# Altium project Module_Ethernet_W5500_V1.0.PrjPcb
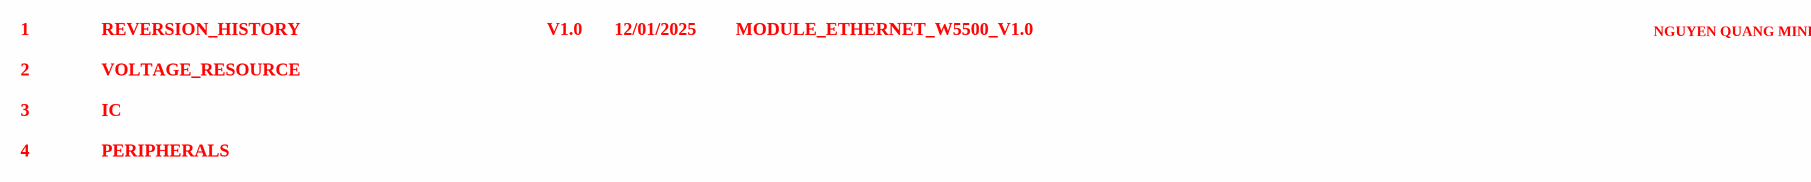
[diagram p0: REVERSION_HISTORY.SchDoc]
4 sheets, 48 parts. Net scope: global (net labels, ports and power ports of the same name join across sheets).
Board files: PCB_V1.0.PcbDoc, Draft_PCB.PcbDoc
Sheets:
  REVERSION_HISTORY.SchDoc
  VOLTAGE_RESOURCE.SchDoc
  IC.SchDoc
  PERIPHERALS.SchDoc

## Sheet REVERSION_HISTORY.SchDoc: REVERSION_HISTORY
size A3; SheetNumber: 1; SheetTotal: 4; ProjectTitle: Module_Ethernet_W5500

### Notes on the sheet
- 1
- REVERSION_HISTORY
- V1.0
- 12/01/2025
- MODULE_ETHERNET_W5500_V1.0
- NGUYEN QUANG MINH
- 2
- 3
- VOLTAGE_RESOURCE
- IC
- 4
- PERIPHERALS
- TABLES OF CONTENTS
- REVISION HISTORY
- PAGE
- CONTENTS
- VER#
- DATE
- REVISIONS
- DESCRIPTION OF CHANGES
- AUTHOR
- Author:
- Title:
- Size:
- A3
- Project:
- Revision:
- Modified Date:
- CheckedBy:
- Date:
- SW Version:

## Sheet VOLTAGE_RESOURCE.SchDoc: VOLTAGE_RESOURCE
size A4; Organization: My Company; Address1: Address Line 1; Address2: Address Line 2; Address3: Address Line 3; Address4: Address Line 4; SheetNumber: 2; SheetTotal: 4; ProjectTitle: Module_Ethernet_W5500
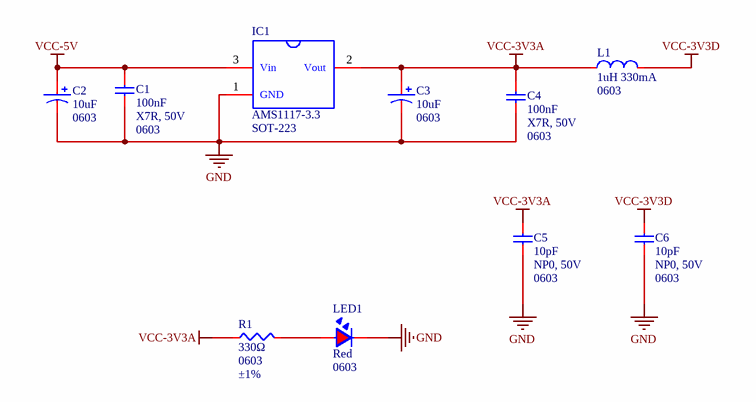
[diagram p1: VOLTAGE_RESOURCE.SchDoc]

### Parts
C1  100nF  Temperature Coefficient: X7R, 50V  Package: 0603  [C0603]
C2  10uF  Package: 0603  [C0603 - TANTA]
C3  10uF  Package: 0603  [C0603 - TANTA]
C4  100nF  Temperature Coefficient: X7R, 50V  Package: 0603  [C0603]
C5  10pF  Temperature Coefficient: NP0, 50V  Package: 0603  [C0603]
C6  10pF  Temperature Coefficient: NP0, 50V  Package: 0603  [C0603]
IC1  AMS1117-3.3  [SOT-223]
L1  1uH 330mA  Package: 0603  [L_0603]
LED1  Red  Package: 0603  [LED0603_RED]
R1  330Ω  Package: 0603  Tolerance: ±1%  [R0603]

### Nets
GND: C1.1 C2.2 C3.2 C4.1 C5.1 C6.1 IC1.1(GND) LED1.2
VCC-3V3A: C3.1 C4.2 C5.2 IC1.2(Vout) L1.1 R1.1
VCC-3V3D: C6.2 L1.2
VCC-5V: C1.2 C2.1 IC1.3(Vin)
NetLED1_1: LED1.1 R1.2

### Notes on the sheet
- Author:
- Title:
- Size:
- A4
- Project:
- Approved:
- Revision:
- Modified Date:
- CONFIDENTIAL
- Date:
- SW Version:

### Library data of the parts
C1 C4 = C0603_MLCC_100nF_X7R_50V: 50V 100nF X7R ±10% 0603 Multilayer Ceramic Capacitors MLCC - SMD/SMT ROHS; Manufacturer: YAGEO; Mfr. Part: CC0603KRX7R9BB104; LCSC Part: C14663; Capacitance: 100nF; Link: https://www.lcsc.com/product-detail/C14663.html; Tolerance: ±10%; Voltage Rating: 50V
C2 C3 = C0603_TANTA_10uF_6.3V: 10uF ±20% 6.3V Tantalum Capacitors 10Ω@100kHz 0603; Manufacturer: VISHAY; Mfr. Part: TMCJ0J106MTRF; Equivalent Series Resistance(ESR): 10H@100kHz; LCSC Part: C1953982; Capacitance: 10uF; Link: https://www.lcsc.com/product-detail/C1953982.html; Tolerance: ±20%; Voltage Rating: 6.3V; Operating Temperature: -55℃~+125℃
C5 C6 = C0603_MLCC_10pF_NP0_50V: 50V 10pF NP0 ±5% 0603 Multilayer Ceramic Capacitors MLCC - SMD/SMT ROHS; Manufacturer: YAGEO; Mfr. Part: CC0603JRNPO9BN100; LCSC Part: C106245; Capacitance: 10pF; Link: https://www.lcsc.com/product-detail/C106245.html; Tolerance: ±5%; Voltage Rating: 50V
IC1 = AMS1117-3.3_SOT-223: 72dB@(120Hz) 1A Fixed 3.3V Positive 16V SOT-223 Voltage Regulators - Linear, Low Drop Out (LDO) Regulators ROHS; Manufacturer: Advanced Monolithic Systems; Voltage Dropout: 1.1V@(800mA); Number of Outputs: 1; Mfr. Part: AMS1117-3.3; LCSC Part: C6186; Link: https://www.lcsc.com/product-detail/C6186.html?s_z=n_AMS1117-3.3; Category: Power Management (PMIC)/Voltage Regulators - Linear, Low Drop Out (LDO) Regulators; Output Current: 1A; Output Voltage: 3.3V; Output Configuration: Positive; Operating Temperature: -40℃~+125℃; Voltage - Supply: 16V; Package: SOT-223
L1 = L_1uH_0603_330mA: 330mA 1uH ±10% 810mΩ Wire-wound chip inductor 0603 Fixed Inductors RoHS; Manufacturer: APV; Manufacture Part Number: AHW1608F-1R0KTF; Link: https://www.lcsc.com/product-detail/C6364703.html; Inductor: 1uH; Current: 330mA; LCSC Part: C6364703
LED1 = LED0603_Red: 20mA 230mcd Water Clear -40℃~+85℃ 630nm Red 120° 75mW 1.95V 0603 LED Indication - Discrete ROHS; Manufacturer: Kingbright; Mfr. Part: APT1608SURCK; Key Attributes: 1.6 x 0.8 mm SMD Chip LED Lamp; LCSC Part: C5875723; Illumination Color: Red; Power(Watts): 75mW; Voltage - Forward(Vf): 1.95V; Forward Current: 20mA; Operating Temperature: -40℃~+85℃; Link: https://www.lcsc.com/product-detail/C5875723.html
R1 = R0603_330Ω_±1%: 100mW Thick Film Resistor 75V ±100ppm/℃ ±1% 330Ω 0603 Chip Resistor - Surface Mount ROHS; Manufacturer: YAGEO; Mfr. Part: RC0603FR-07330RL; LCSC Part: C105881; Resistance: 330Ω; Operating Temperature: -55℃~+155℃; Link: https://www.lcsc.com/product-detail/C105881.html

## Sheet IC.SchDoc: IC
size A4; Organization: My Company; Address1: Address Line 1; Address2: Address Line 2; Address3: Address Line 3; Address4: Address Line 4; SheetNumber: 3; SheetTotal: 4; ProjectTitle: Module_Ethernet_W5500
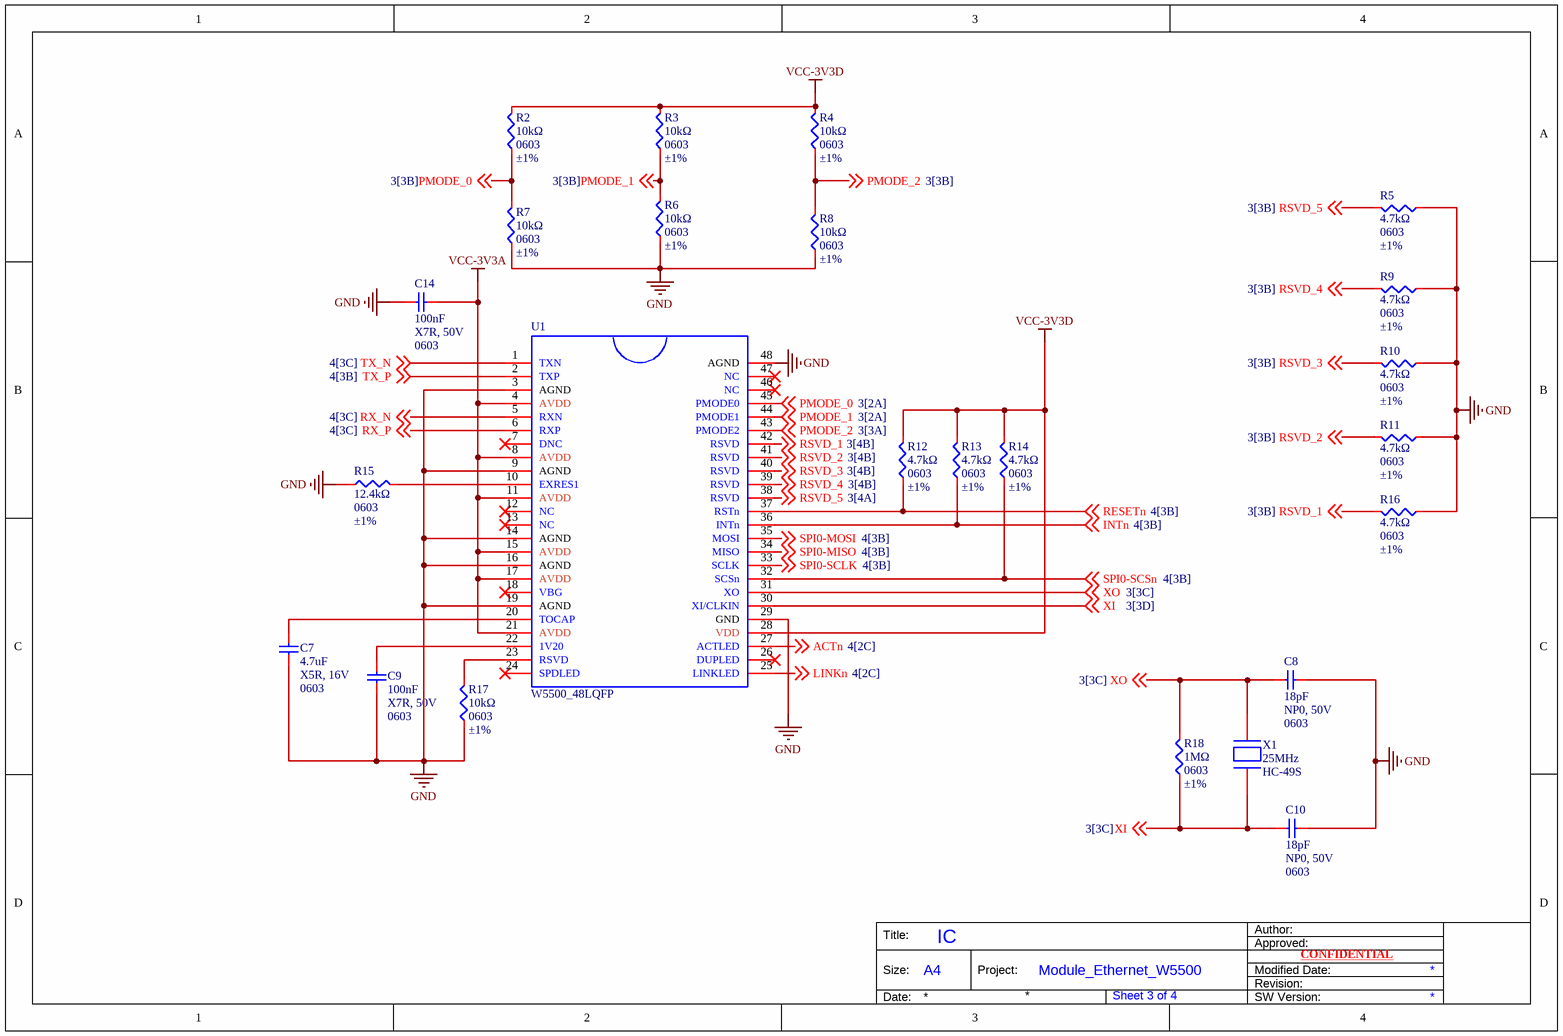
[diagram p2: IC.SchDoc]

### Parts
C7  4.7uF  Temperature Coefficient: X5R, 16V  Package: 0603  [C0603]
C8  18pF  Temperature Coefficient: NP0, 50V  Package: 0603  [C0603]
C9  100nF  Temperature Coefficient: X7R, 50V  Package: 0603  [C0603]
C10  18pF  Temperature Coefficient: NP0, 50V  Package: 0603  [C0603]
C14  100nF  Temperature Coefficient: X7R, 50V  Package: 0603  [C0603]
R2  10kΩ  Package: 0603  Tolerance: ±1%  [R0603]
R3  10kΩ  Package: 0603  Tolerance: ±1%  [R0603]
R4  10kΩ  Package: 0603  Tolerance: ±1%  [R0603]
R5  4.7kΩ  Package: 0603  Tolerance: ±1%  [R0603]
R6  10kΩ  Package: 0603  Tolerance: ±1%  [R0603]
R7  10kΩ  Package: 0603  Tolerance: ±1%  [R0603]
R8  10kΩ  Package: 0603  Tolerance: ±1%  [R0603]
R9  4.7kΩ  Package: 0603  Tolerance: ±1%  [R0603]
R10  4.7kΩ  Package: 0603  Tolerance: ±1%  [R0603]
R11  4.7kΩ  Package: 0603  Tolerance: ±1%  [R0603]
R12  4.7kΩ  Package: 0603  Tolerance: ±1%  [R0603]
R13  4.7kΩ  Package: 0603  Tolerance: ±1%  [R0603]
R14  4.7kΩ  Package: 0603  Tolerance: ±1%  [R0603]
R15  12.4kΩ  Package: 0603  Tolerance: ±1%  [R0603]
R16  4.7kΩ  Package: 0603  Tolerance: ±1%  [R0603]
R17  10kΩ  Package: 0603  Tolerance: ±1%  [R0603]
R18  1MΩ  Package: 0603  Tolerance: ±1%  [R0603]
U1  W5500_48LQFP  [48LQFP (7*7)]
X1  25MHz  [HC-49S]

### Nets
GND: C7.1 C8.2 C9.1 C10.2 C14.2 R5.1 R6.1 R7.1 R8.1 R9.1 R10.1 R11.1 R15.1 R16.1 R17.1 U1.3(AGND) U1.9(AGND) U1.14(AGND) U1.16(AGND) U1.19(AGND) U1.29(GND) U1.48(AGND)
VCC-3V3A: C14.1 U1.4(AVDD) U1.8(AVDD) U1.11(AVDD) U1.15(AVDD) U1.17(AVDD) U1.21(AVDD)
VCC-3V3D: R2.2 R3.2 R4.2 R12.2 R13.2 R14.2 U1.28(VDD)
ACTn: U1.27(ACTLED) ; off-sheet ACTn
INTn: R13.1 U1.36(INTn) ; off-sheet INTn
LINKn: U1.25(LINKLED) ; off-sheet LINKn
PMODE_0: R2.1 R7.2 U1.45(PMODE0) ; off-sheet PMODE_0
PMODE_1: R3.1 R6.2 U1.44(PMODE1) ; off-sheet PMODE_1
PMODE_2: R4.1 R8.2 U1.43(PMODE2) ; off-sheet PMODE_2
RESETn: R12.1 U1.37(RSTn) ; off-sheet RESETn
RSVD_1: R16.2 U1.42(RSVD) ; off-sheet RSVD_1
RSVD_2: R11.2 U1.41(RSVD) ; off-sheet RSVD_2
RSVD_3: R10.2 U1.40(RSVD) ; off-sheet RSVD_3
RSVD_4: R9.2 U1.39(RSVD) ; off-sheet RSVD_4
RSVD_5: R5.2 U1.38(RSVD) ; off-sheet RSVD_5
RX_N: U1.5(RXN) ; off-sheet RX_N
RX_P: U1.6(RXP) ; off-sheet RX_P
SPI0-MISO: U1.34(MISO) ; off-sheet SPI0-MISO
SPI0-MOSI: U1.35(MOSI) ; off-sheet SPI0-MOSI
SPI0-SCLK: U1.33(SCLK) ; off-sheet SPI0-SCLK
SPI0-SCSn: R14.1 U1.32(SCSn) ; off-sheet SPI0-SCSn
TX_N: U1.1(TXN) ; off-sheet TX_N
TX_P: U1.2(TXP) ; off-sheet TX_P
XI: C10.1 R18.1 U1.30(XI/CLKIN) X1.1 ; off-sheet XI
XO: C8.1 R18.2 U1.31(XO) X1.2 ; off-sheet XO
NetC7_2: C7.2 U1.20(TOCAP)
NetC9_2: C9.2 U1.22(1V20)
NetR15_2: R15.2 U1.10(EXRES1)
NetR17_2: R17.2 U1.23(RSVD)

Not connected (* = marked no-connect by the designer): U1 7(DNC)* 12(NC)* 13(NC)* 18(VBG)* 24(SPDLED)* 26(DUPLED)* 46(NC)* 47(NC)*

### Notes on the sheet
- Author:
- Title:
- Size:
- A4
- Project:
- Approved:
- Revision:
- Modified Date:
- CONFIDENTIAL
- Date:
- SW Version:

### Library data of the parts
C7 = C0603_MLCC_4.7uF_X5R_16V: 4.7uF ±10% 16V Ceramic Capacitor X5R 0603; Manufacturer: Samsung Electro-Mechanics; Mfr. Part: CL10A475KO8NNNC; LCSC Part: C19666; Capacitance: 4.7uF; Link: https://www.lcsc.com/product-detail/C19666.html; Voltage Rating: 16V; Tolerance: ±10%
C8 C10 = C0603_MLCC_18pF_NP0_50V: 18pF ±5% 50V Ceramic Capacitor NP0 0603; Manufacturer: YAGEO; Mfr. Part: CC0603JRNPO9BN180; LCSC Part: C107040; Capacitance: 18pF; Link: https://www.lcsc.com/product-detail/C107040.html; Tolerance: ±5%; Voltage Rating: 50V
C9 C14 = C0603_MLCC_100nF_X7R_50V: as C1 on sheet VOLTAGE_RESOURCE; LCSC Part: C14663; Capacitance: 100nF; Link: https://www.lcsc.com/product-detail/C14663.html; Tolerance: ±10%; Voltage Rating: 50V
R2-R4 R6-R8 R17 = R0603_10kΩ_±1%: 100mW Thick Film Resistor 75V ±100ppm/℃ ±1% 10kΩ 0603 Chip Resistor - Surface Mount ROHS; Manufacturer: YAGEO; Mfr. Part: RC0603FR-0710KL; LCSC Part: C98220; Resistance: 10kΩ; Operating Temperature: -55℃~+155℃; Link: https://www.lcsc.com/product-detail/C98220.html
R5 R9-R14 R16 = R0603_4.7kΩ_±1%: 100mW Thick Film Resistor 75V ±100ppm/℃ ±1% 4.7kΩ 0603 Chip Resistor - Surface Mount ROHS; Manufacturer: YAGEO; Mfr. Part: RC0603FR-074K7L; LCSC Part: C99782; Resistance: 4.7kΩ; Operating Temperature: -55℃~+155℃; Link: https://www.lcsc.com/product-detail/C99782.html
R15 = R0603_12.4kΩ_±1%: 100mW 12.4kΩ 75V Thick Film Resistor ±100ppm/℃ ±1% 0603 Chip Resistor - Surface Mount RoHS; Manufacturer: YAGEO; Mfr. Part: RC0603FR-0712K4L; LCSC Part: C137798; Resistance: 12.4kΩ; Operating Temperature: -55℃~+155℃; Link: https://www.lcsc.com/product-detail/C137798.html
R18 = R0603_1MΩ_±1%: 100mW Thick Film Resistor 75V ±100ppm/℃ ±1% 1MΩ 0603 Chip Resistor - Surface Mount ROHS; Manufacturer: YAGEO; Mfr. Part: RC0603FR-071ML; LCSC Part: C105578; Resistance: 1MΩ; Operating Temperature: -55℃~+155℃; Link: https://www.lcsc.com/product-detail/C105578.html
U1 = W5500_48LQFP: LQFP-48(7x7) Interface Controllers RoHS; Manufacturer: WIZNETTHE TICKET; Mfr. Part: TPS61175PWPR; Voltage - Supply: 3.3V; Ethernet Speed Standards: 10BASE-T; 100BASE-TX; Protocol: SPI; Memory Space: 32KB; Number of Channels: 8; Package: LQFP-48(7x7); LCSC Part: C32843; Link: https://www.lcsc.com/product-detail/C32843.html?s_z=n_w5500%252048lqfp; MAC Interface: SPI; Operating Temperature: -40℃~+85℃
X1 = Crystal_25Mhz_HC49S: Crystal 25MHz ±20ppm 20pF HC-49S; Manufacturer: YXC Crystal Oscillators; Mfr. Part: X49SD25MSD2SC; Frequency Stability: ±30ppm; LCSC Part: C14730; Frequency: 25MHz; Type: Through Hole Crystal Oscillator; Load Capacitance: 20pF; Operating Temperature: -20℃~+70℃; Link: https://www.lcsc.com/product-detail/C14730.html; Package: HC-49S

## Sheet PERIPHERALS.SchDoc: PERIPHERALS
size A4; Organization: My Company; Address1: Address Line 1; Address2: Address Line 2; Address3: Address Line 3; Address4: Address Line 4; SheetNumber: 4; SheetTotal: 4; ProjectTitle: Module_Ethernet_W5500
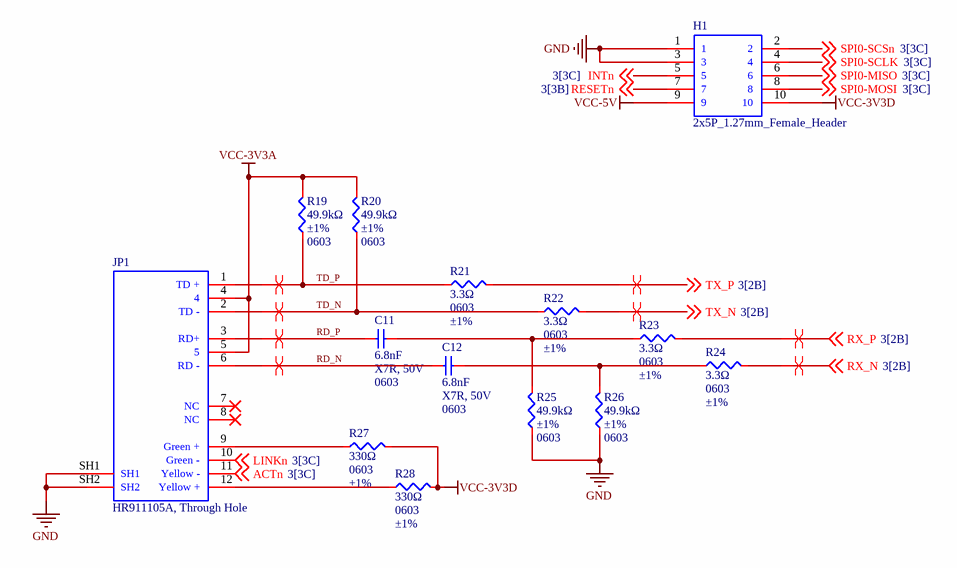
[diagram p3: PERIPHERALS.SchDoc]

### Parts
C11  6.8nF  Temperature Coefficient: X7R, 50V  Package: 0603  [C0603]
C12  6.8nF  Temperature Coefficient: X7R, 50V  Package: 0603  [C0603]
H1  2x5P_1.27mm_Female_Header  [2x5P, 1.27mm, Female Header]
JP1  HR911105A, Through Hole  [HR911105A]
R19  49.9kΩ  Tolerance: ±1%  Package: 0603  [R0603]
R20  49.9kΩ  Tolerance: ±1%  Package: 0603  [R0603]
R21  3.3Ω  Package: 0603  Tolerance: ±1%  [R0603]
R22  3.3Ω  Package: 0603  Tolerance: ±1%  [R0603]
R23  3.3Ω  Package: 0603  Tolerance: ±1%  [R0603]
R24  3.3Ω  Package: 0603  Tolerance: ±1%  [R0603]
R25  49.9kΩ  Tolerance: ±1%  Package: 0603  [R0603]
R26  49.9kΩ  Tolerance: ±1%  Package: 0603  [R0603]
R27  330Ω  Package: 0603  Tolerance: ±1%  [R0603]
R28  330Ω  Package: 0603  Tolerance: ±1%  [R0603]

### Nets
GND: H1.1 H1.3 JP1.SH1 JP1.SH2 R25.1 R26.1
VCC-3V3A: JP1.4 JP1.5 R19.2 R20.2
VCC-3V3D: H1.10 R27.2 R28.2
VCC-5V: H1.9
ACTn: JP1.11(Yellow_-) ; off-sheet ACTn
INTn: H1.5 ; off-sheet INTn
LINKn: JP1.10(Green_-) ; off-sheet LINKn
RD_N: C12.1 JP1.6(RD_-)
RD_P: C11.1 JP1.3(RD+)
RESETn: H1.7 ; off-sheet RESETn
RX_N: R24.2 ; off-sheet RX_N
RX_P: R23.2 ; off-sheet RX_P
SPI0-MISO: H1.6 ; off-sheet SPI0-MISO
SPI0-MOSI: H1.8 ; off-sheet SPI0-MOSI
SPI0-SCLK: H1.4 ; off-sheet SPI0-SCLK
SPI0-SCSn: H1.2 ; off-sheet SPI0-SCSn
TD_N: JP1.2(TD_-) R20.1 R22.1
TD_P: JP1.1(TD_+) R19.1 R21.1
TX_N: R22.2 ; off-sheet TX_N
TX_P: R21.2 ; off-sheet TX_P
NetC11_2: C11.2 R23.1 R25.2
NetC12_2: C12.2 R24.1 R26.2
NetJP1_9: JP1.9(Green_+) R27.1
NetJP1_12: JP1.12(Yellow_+) R28.1

Not connected (* = marked no-connect by the designer): JP1 7(NC)* 8(NC)*

### Layout directives
differential pair: RD_N, RD_P, RX_N, RX_P, TD_N, TD_P, TX_N, TX_P

### Notes on the sheet
- Author:
- Title:
- Size:
- A4
- Project:
- Approved:
- Revision:
- Modified Date:
- CONFIDENTIAL
- Date:
- SW Version:

### Library data of the parts
C11 C12 = C0603_MLCC_6.8nF_X7R_50V: 6.8nF ±10% 50V Ceramic Capacitor X7R 0603; Manufacturer: YAGEO; Mfr. Part: CC0603KRX7R9BB682; LCSC Part: C107097; Capacitance: 6.8nF; Link: https://www.lcsc.com/product-detail/C107097.html; Tolerance: ±10%; Voltage Rating: 50V
H1 = 2x5P_1.27mm_Female_Header: Female Header 10 Position 1.27mm Pitch Dual Row Through Hole -40℃~+105℃; Manufacturer: Megastar; Mfr. Part: ZX-PM1.27-2-5PU; Holes Structure: 2x5P; Key Attributes: CONN SOCKET 10POS 1.27mm DUAL ROW TH; LCSC Part: C7499360; Package: Through Hole,P=1.27mm; Link: https://www.lcsc.com/product-detail/C7499360.html
JP1 = HR911105A: CONN MOD JACK RJ45 TH; Manufacturer: HANRUN(Zhongshan HanRun Elec); Mfr. Part: HR911105A; LCSC Part: C12074; Package: Through Hole; Link: https://www.lcsc.com/product-detail/C12074.html
R19 R20 R25 R26 = R0603_49.9KΩ_±1%: 100mW Thick Film Resistor 75V ±100ppm/℃ ±1% 49.9kΩ 0603 Chip Resistor - Surface Mount ROHS; Manufacturer: YAGEO; Mfr. Part: RC0603FR-0749K9L; LCSC Part: C114624; Resistance: 49.9kΩ; Operating Temperature: -55℃~+155℃; Link: https://www.lcsc.com/product-detail/C114624.html?s_z=n_C114624
R21-R24 = R0603_3.3Ω_±1%: 3.3Ω ±1% 100mW 0603 Thick Film Resistor; Manufacturer: UNI-ROYAL; Mfr. Part: 0603WAF330KT5E; Voltage Rating: 75V; LCSC Part: C22979; Resistance: 3.3Ω; Operating Temperature: -55℃~+155℃; Link: https://www.lcsc.com/product-detail/C22979.html
R27 R28 = R0603_330Ω_±1%: as R1 on sheet VOLTAGE_RESOURCE; LCSC Part: C105881; Resistance: 330Ω; Operating Temperature: -55℃~+155℃; Link: https://www.lcsc.com/product-detail/C105881.html

## Nets that join several sheets
GND: VOLTAGE_RESOURCE (8 pins), IC (22 pins), PERIPHERALS (6 pins)
VCC-3V3A: VOLTAGE_RESOURCE (6 pins), IC (7 pins), PERIPHERALS (JP1.4 JP1.5 R19.2 R20.2)
VCC-3V3D: VOLTAGE_RESOURCE (C6.2 L1.2), IC (7 pins), PERIPHERALS (H1.10 R27.2 R28.2)
VCC-5V: VOLTAGE_RESOURCE (C1.2 C2.1 IC1.3), PERIPHERALS (H1.9)
ACTn: IC (U1.27), PERIPHERALS (JP1.11)
INTn: IC (R13.1 U1.36), PERIPHERALS (H1.5)
LINKn: IC (U1.25), PERIPHERALS (JP1.10)
RESETn: IC (R12.1 U1.37), PERIPHERALS (H1.7)
RX_N: IC (U1.5), PERIPHERALS (R24.2)
RX_P: IC (U1.6), PERIPHERALS (R23.2)
SPI0-MISO: IC (U1.34), PERIPHERALS (H1.6)
SPI0-MOSI: IC (U1.35), PERIPHERALS (H1.8)
SPI0-SCLK: IC (U1.33), PERIPHERALS (H1.4)
SPI0-SCSn: IC (R14.1 U1.32), PERIPHERALS (H1.2)
TX_N: IC (U1.1), PERIPHERALS (R22.2)
TX_P: IC (U1.2), PERIPHERALS (R21.2)